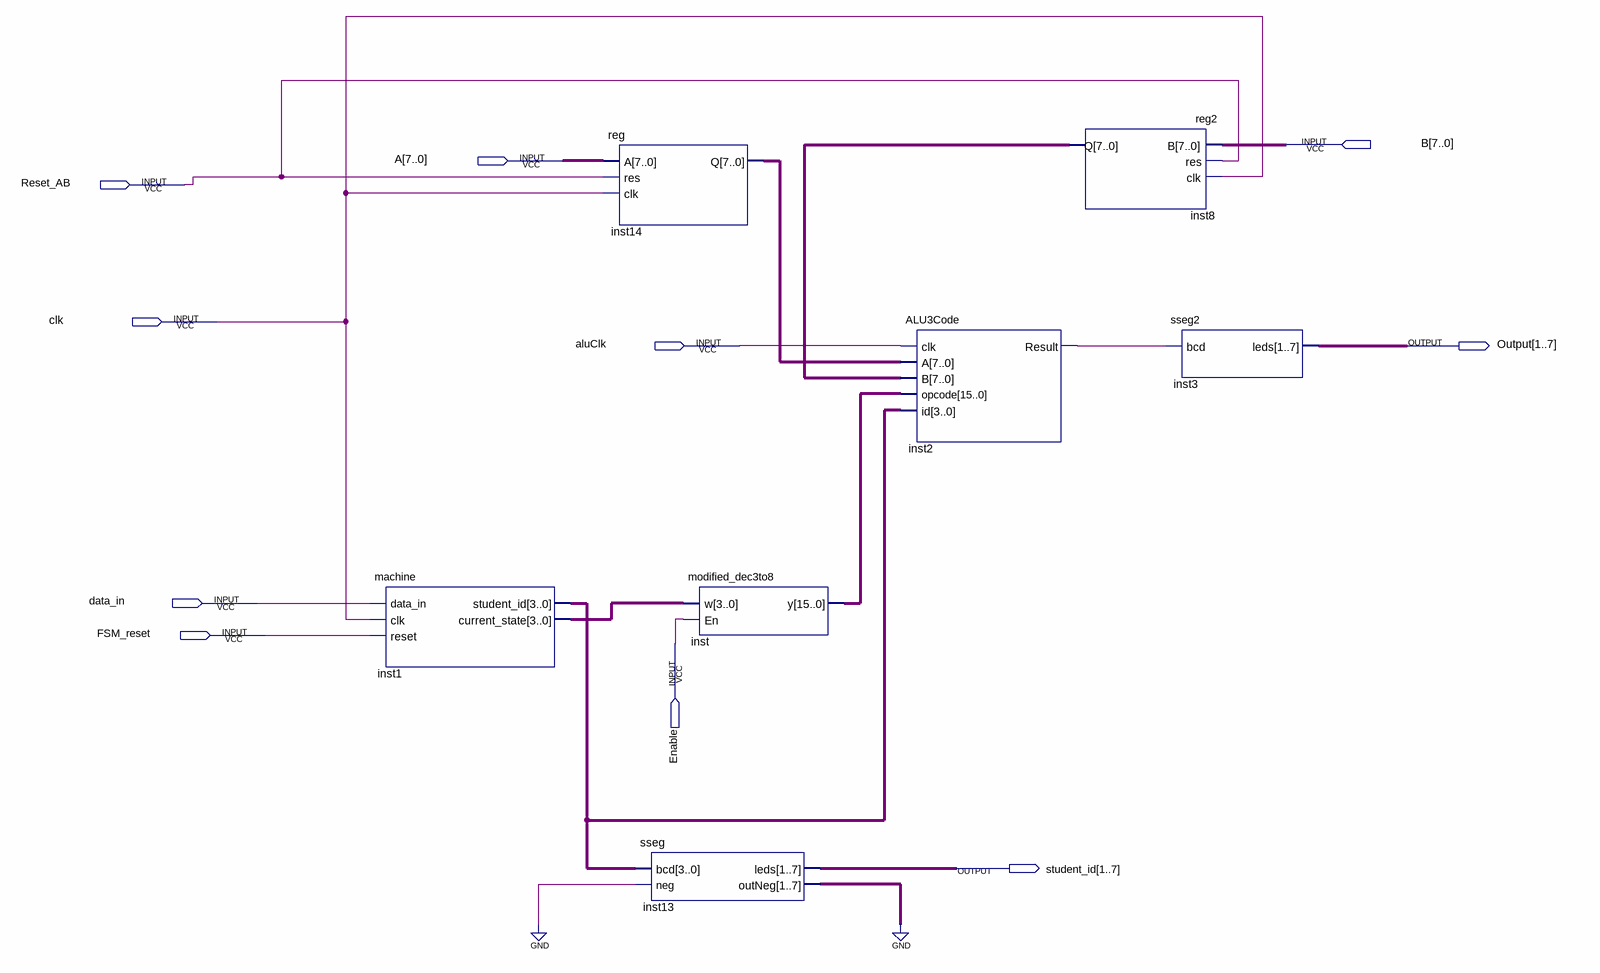
[diagram p0: schematic sheet]
// Quartus schematic ALU3BD.bdf as structural Verilog: 7 symbols, 10 pins
module ALU3BD (
  input  [7:0] B,
  input  [7:0] A,
  input  Reset_AB,
  input  clk,
  input  aluClk,
  input  data_in,
  input  FSM_reset,
  input  Enable,
  output [1:7] Output,
  output [1:7] student_id
);

  wire inst2_result;
  wire [3:0] inst1_current_state, inst1_student_id;
  wire [6:0] inst13_outneg;
  wire [7:0] inst8_q, inst14_q;
  wire [15:0] inst_y;

  machine inst1 (
    .data_in(data_in), .clk(clk), .reset(FSM_reset), .student_id(inst1_student_id),
    .current_state(inst1_current_state));
  \reg  inst14 (.A(A), .res(Reset_AB), .clk(clk), .Q(inst14_q));
  modified_dec3to8 inst (.w(inst1_current_state), .En(Enable), .y(inst_y));
  sseg inst13 (.bcd(inst1_student_id), .neg(1'b0), .leds(student_id), .outNeg(inst13_outneg));
  ALU3Code inst2 (
    .clk(aluClk), .A(inst14_q), .B(inst8_q), .opcode(inst_y), .id(inst1_student_id), .Result(inst2_result));
  reg2 inst8 (.B(B), .res(Reset_AB), .clk(clk), .Q(inst8_q));
  sseg2 inst3 (.bcd(inst2_result), .leds(Output));
  // also tied to GND on the sheet: {inst13_outneg[0], inst13_outneg[1], inst13_outneg[2], inst13_outneg[3], inst13_outneg[4], inst13_outneg[5], inst13_outneg[6]}
endmodule
